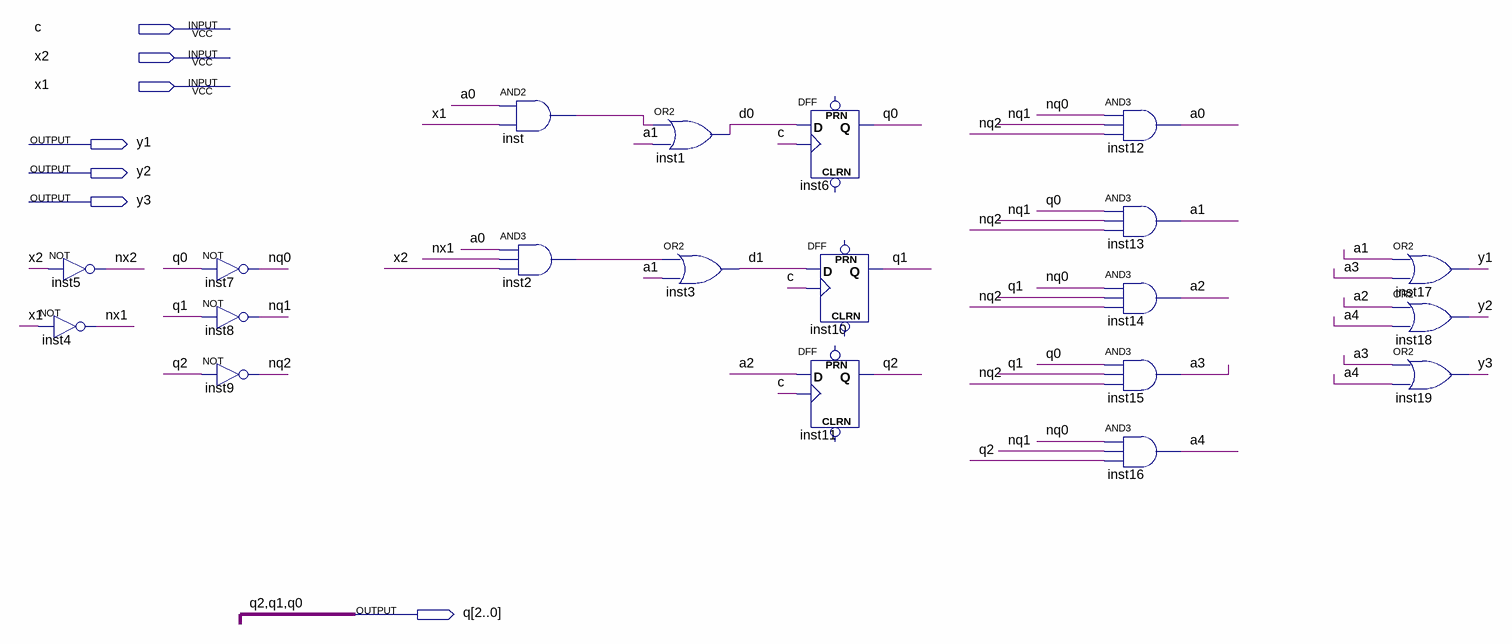
[diagram p0: schematic sheet]
// Quartus schematic s11_moore.bdf as structural Verilog: 20 symbols, 7 pins
module s11_moore (
  input  c,
  input  x2,
  input  x1,
  output y1,
  output y2,
  output y3,
  output [2:0] q
);

  wire a0, a1, a2, a3, a4, d0, d1, inst2_out, inst_out, nq0, nq1, nq2, nx1, nx2;

  not inst5 (nx2, x2);
  not inst4 (nx1, x1);
  not inst7 (nq0, q[0]);
  not inst8 (nq1, q[1]);
  not inst9 (nq2, q[2]);
  and inst (inst_out, a0, x1);
  and inst2 (inst2_out, a0, nx1, x2);
  or inst1 (d0, inst_out, a1);
  or inst3 (d1, inst2_out, a1);
  DFF inst6 (.CLK(c), .D(d0), .Q(q[0]));  // open: CLRN, PRN
  DFF inst10 (.CLK(c), .D(d1), .Q(q[1]));  // open: CLRN, PRN
  DFF inst11 (.CLK(c), .D(a2), .Q(q[2]));  // open: CLRN, PRN
  and inst12 (a0, nq0, nq1, nq2);
  and inst13 (a1, q[0], nq1, nq2);
  and inst14 (a2, nq0, q[1], nq2);
  and inst15 (a3, q[0], q[1], nq2);
  and inst16 (a4, nq0, nq1, q[2]);
  or inst17 (y1, a1, a3);
  or inst18 (y2, a2, a4);
  or inst19 (y3, a3, a4);
endmodule
